# Altium project PCB_Project2.PrjPCB
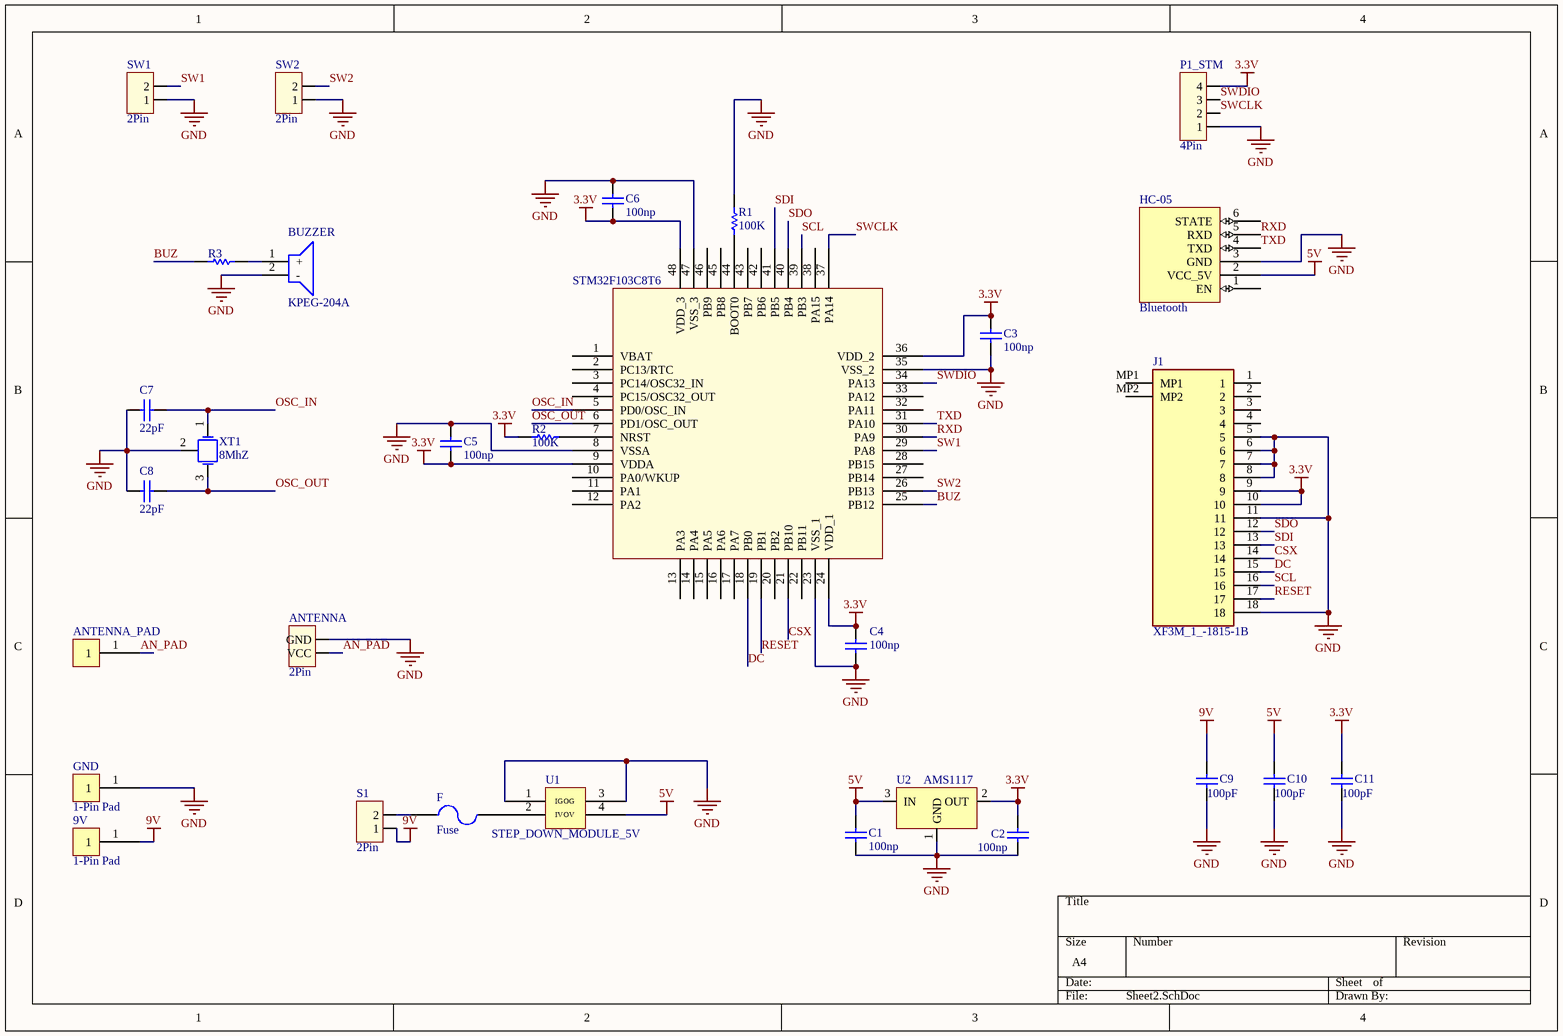
[diagram p0: Sheet2.SchDoc]
1 sheet, 30 parts. Net scope: global (net labels, ports and power ports of the same name join across sheets).
Board file: PCB1.PcbDoc

## Sheet Sheet2.SchDoc
size A4

### Parts
9V  1-Pin Pad  [1-Pin Pad]
ANTENNA  2Pin  [XH2.54-2pin]
ANTENNA_PAD  1-Pin Pad  [1-Pin Pad]  (value not drawn)
BUZZER  KPEG-204A  [KPEG204A]
C1  100np  [C0805]
C2  100np  [C0805]
C3  100np  [C0805]
C4  100np  [C0805]
C5  100np  [C0805]
C6  100np  [C0805]
C7  22pF  [C0805]
C8  22pF  [C0805]
C9  100pF  [C0805]
C10  100pF  [C0805]
C11  100pF  [C0805]
F  Fuse  [FUSE-PPTC-30V - 5A]
GND  1-Pin Pad  [1-Pin Pad]
HC-05  Bluetooth  [hc-05]
J1  XF3M_1_-1815-1B  [68711814022]
P1_STM  4Pin  [XH2.54-4pin]
R1  100K  [R0805]
R2  100K  [R0805]
R3  1000  [R0805]  (value not drawn)
S1  2Pin  [XH2.54-2pin]
STM  STM32F103C8T6  [LQFP48]
SW1  2Pin  [XH2.54-2pin]
SW2  2Pin  [XH2.54-2pin]
U1  STEP_DOWN_MODULE_5V  [STEP_DOWN_MODULE_5V]
U2  AMS1117  [AMS1117 - SOT-223]
XT1  8MhZ  [3225-P]

### Nets
3.3V: C2.2 C3.2 C4.2 C5.1 C6.1 C11.2 J1.9 J1.10 P1_STM.4 R2.1 STM.9(VDDA) STM.24(VDD_1) STM.36(VDD_2) STM.48(VDD_3) U2.2(OUT)
5V: C1.2 C10.2 HC-05.2(VCC_5V) U1.4(OV) U2.3(IN)
9V: 9V.1 C9.2 S1.1
GND: ANTENNA.2(GND) BUZZER.2(-) C1.1 C2.1 C3.1 C4.1 C5.2 C6.2 C7.1 C8.1 C9.1 C10.1 C11.1 GND.1 HC-05.3(GND) J1.5 J1.6 J1.7 J1.8 J1.11 J1.18 P1_STM.1 R1.2 STM.8(VSSA) STM.23(VSS_1) STM.35(VSS_2) STM.47(VSS_3) SW1.1 SW2.1 U1.1(IG) U1.3(OG) U2.1(GND) XT1.2
AN_PAD: ANTENNA.1(VCC) ANTENNA_PAD.1
BUZ: R3.1 STM.25(PB12)
CSX: J1.14 STM.21(PB10)
DC: J1.15 STM.18(PB0)
OSC_IN: C7.2 STM.5(PD0/OSC_IN) XT1.1(OSC1)
OSC_OUT: C8.2 STM.6(PD1/OSC_OUT) XT1.3(OSC2)
RESET: J1.17 STM.19(PB1)
RXD: HC-05.5(RXD) STM.30(PA9)
SCL: J1.16 STM.39(PB3)
SDI: J1.13 STM.41(PB5)
SDO: J1.12 STM.40(PB4)
SW1: STM.29(PA8) SW1.2
SW2: STM.26(PB13) SW2.2
SWCLK: P1_STM.2 STM.37(PA14)
SWDIO: P1_STM.3 STM.34(PA13)
TXD: HC-05.4(TXD) STM.31(PA10)
NetBUZZER_1: BUZZER.1(+) R3.2
NetF_1: F.1 S1.2
NetF_2: F.2 U1.2(IV)
NetR1_1: R1.1 STM.44(BOOT0)
NetR2_2: R2.2 STM.7(NRST)

Not connected (* = marked no-connect by the designer): HC-05 1(EN) 6(STATE); J1 1 2 3 4 MP1 MP2; STM 1(VBAT) 2(PC13/RTC) 3(PC14/OSC32_IN) 4(PC15/OSC32_OUT) 10(PA0/WKUP) 11(PA1) 12(PA2) 13(PA3) 14(PA4) 15(PA5) 16(PA6) 17(PA7) 20(PB2) 22(PB11) 27(PB14) 28(PB15) 32(PA11) 33(PA12) 38(PA15) 42(PB6) 43(PB7) 45(PB8) 46(PB9)

### Library data of the parts
BUZZER = KPEG-204A: Loudspeaker or Buzzer; Manufacturer_Name: KINGSTATE; Datasheet Link: http://www.farnell.com/datasheets/16476.pdf; Height: 16.5mm; Manufacturer_Part_Number: KPEG-204A
C1-C11 = Cap: value: *
F = Fuse: PPTC; ComponentLink1Description: Datasheet; ComponentLink1URL: https://www.flying1688.com/products_detail_1566.htm
HC-05 = HC-05
J1 = XF3M_1_-1815-1B: Connector; Manufacturer_Name: Omron Electronics; Manufacturer_Part_Number: XF3M(1)-1815-1B; Datasheet Link: https://omronfs.omron.com/en_US/ecb/products/pdf/en-xf3m.pdf; Height: 2mm; Mouser Part Number: 653-XF3M1-1815-1B; Mouser Price/Stock: https://www.mouser.co.uk/ProductDetail/Omron-Electronics/XF3M1-1815-1B?qs=1He0yLMpldDnA2DlFMO4ew%3D%3D; Arrow Part Number: XF3M(1)-1815-1B; Arrow Price/Stock: https://www.arrow.com/en/products/xf3m118151b/omron
R1-R3 = Resistor_1: value: *
U2 = AMS1117: pin to pad: 2>2+4
XT1 = Passive Crystal: frequency: *